# EAGLE design DMXRX (EAGLE 7.7.0)
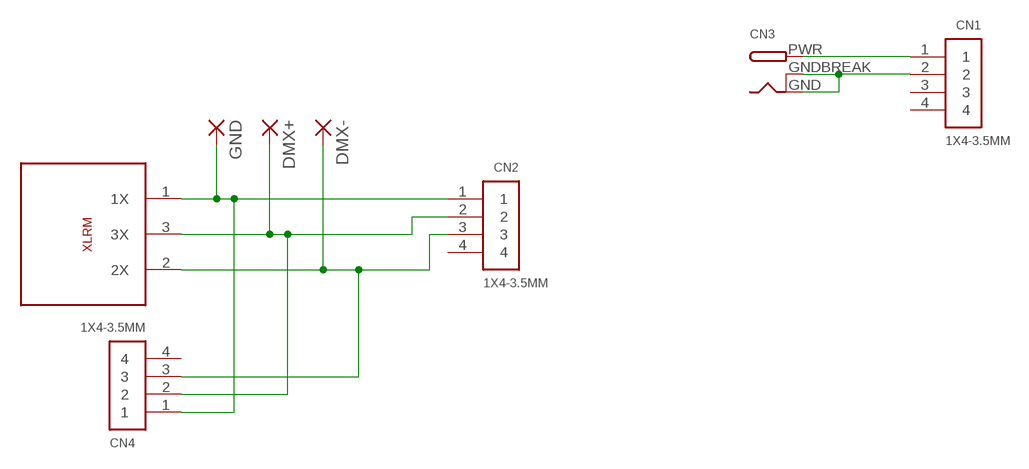
[diagram p0: schematic, sheet 1]

## Parts
CN1  1X4-3.5MM  [1X04-3.5MM]
CN2  1X4-3.5MM  [1X04-3.5MM]
CN3  DCBARRELPTH  [DCJACK_2MM_PTH]
CN4  1X4-3.5MM  [1X04-3.5MM]
DMX+  3,81/1,4  [3,81/1,4]
DMX-  3,81/1,4  [3,81/1,4]
GND  3,81/1,4  [3,81/1,4]
U$1  XLRCONNCTORM  [DMX3PINF]

## Nets
DMX+: CN2.2 CN4.2 DMX+.1(P) U$1.3(3X)
DMX-: CN2.3 CN4.3 DMX-.1(P) U$1.2(2X)
GND: CN2.1 CN4.1 GND.1(P) U$1.1(1X)
GNDP: CN1.2 CN3.GND CN3.GNDBREAK
PWR: CN1.1 CN3.PWR
Unconnected: CN1.3 CN1.4 CN2.4 CN4.4

## Library data of the parts
CN1 CN2 CN4 = adafruit:1X4: 4-pin connector
CN3 = adafruit:DCBARREL: 2.0mm DC Barrel Jack DCJACK_2MM_PTH - Through Hole Jack (4UConnector: 05537)
DMX+ DMX- GND = wirepad:3,81/1,4: THROUGH-HOLE PAD
U$1 = DMX:XLRCONNCTORM: SC1571-ND digikey

## Board
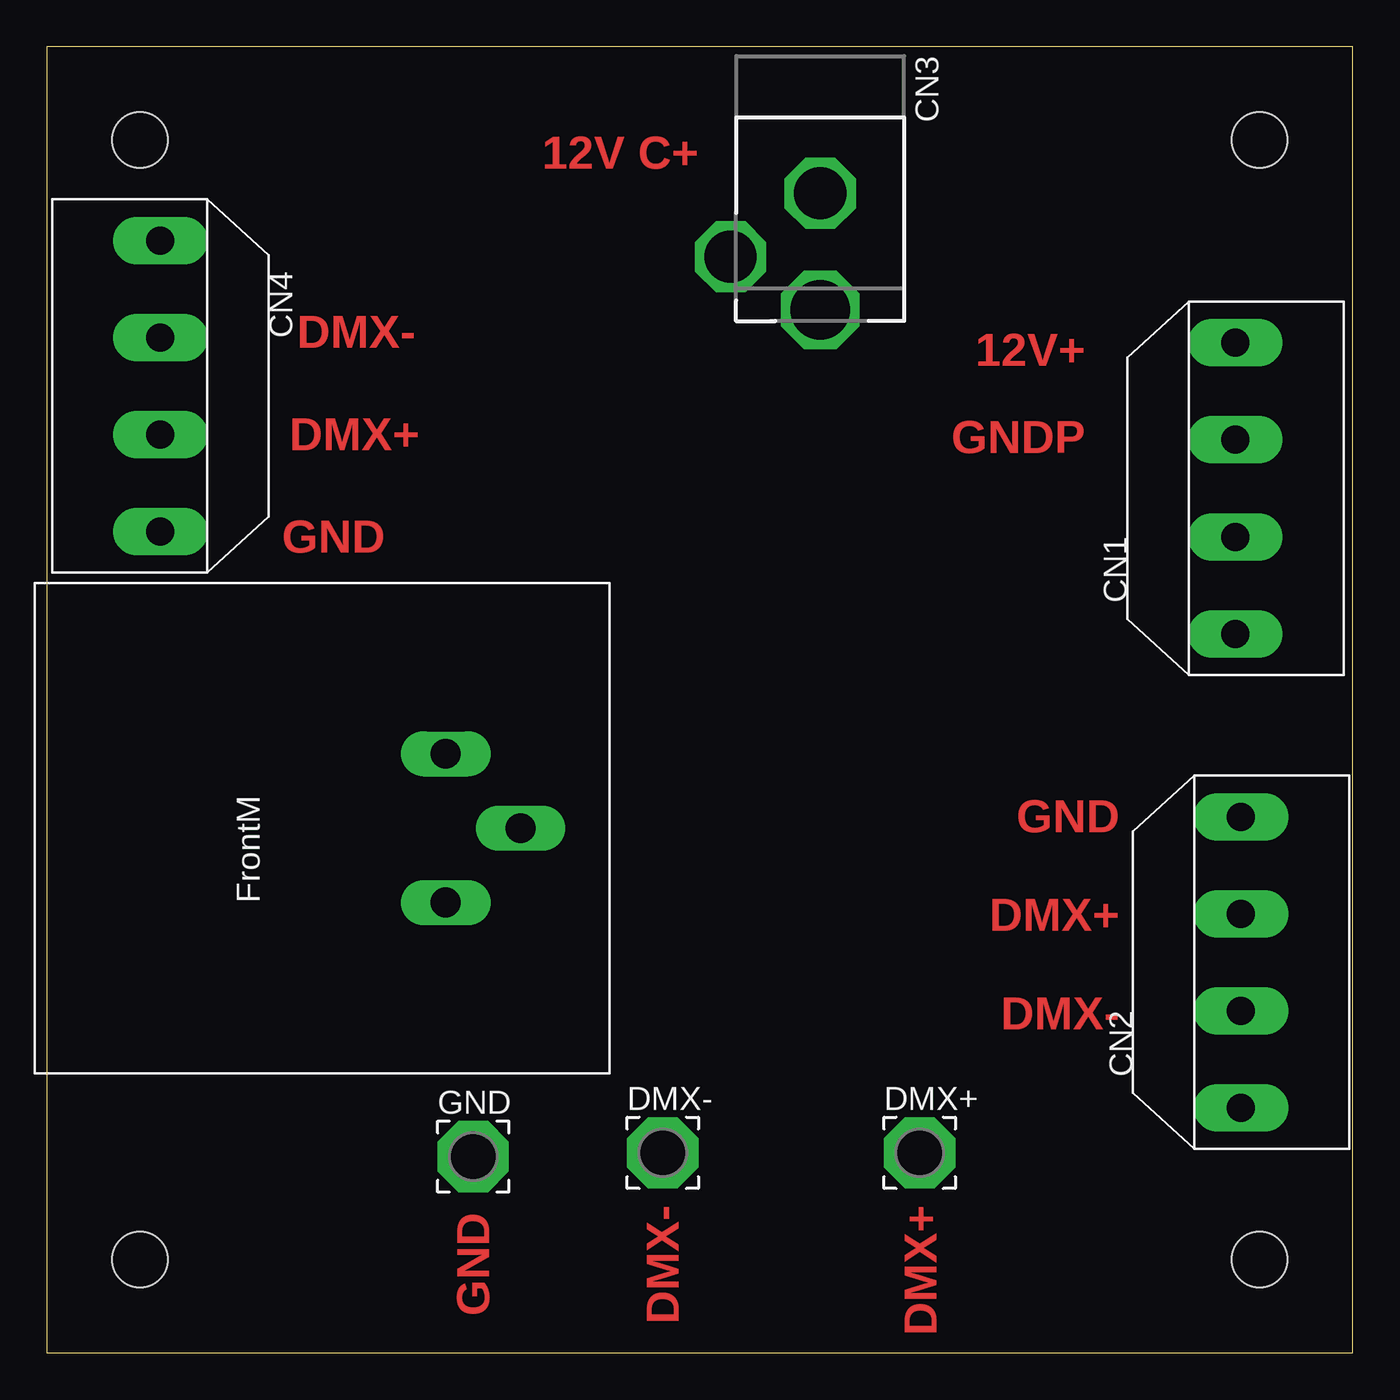
[diagram p1: board, top side]
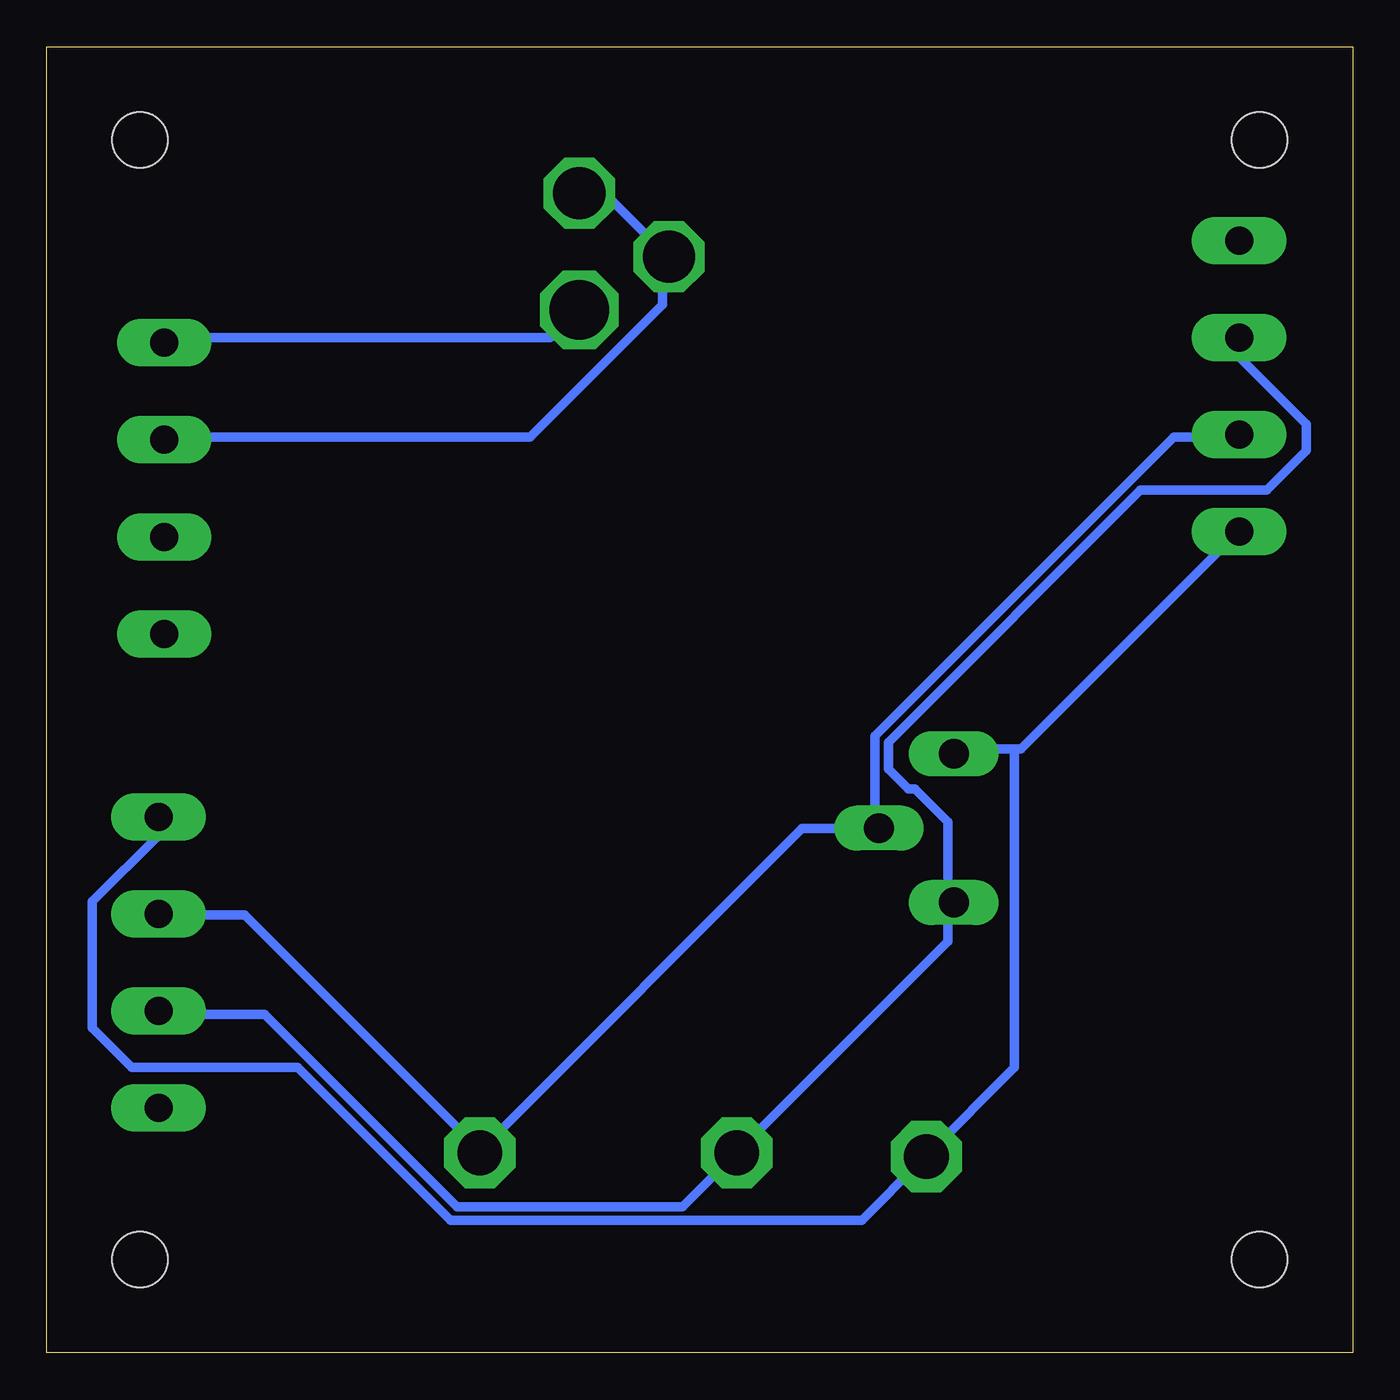
[diagram p2: board, bottom side, seen from below]

Size 70 x 70 mm. Coordinates in mm from the lower left corner, seen from the top.
Outline: 0,0 70,0 70,70 0,70 0,0
Copper layers (1*16): Top 0.035mm / dielectric 1.5mm / Bottom 0.035mm
Design rules "default *": minimum track width 20mil, minimum drill 0.8mm, track to track 8mil, track to pad 20mil, pad to pad 8mil, via to via 8mil, smd to smd 8mil, copper to edge 40mil, drill to drill 8mil, minimum pad ring 10mil, minimum via ring 8mil, stop-mask expansion 4mil, vias tented up to drill 0mil, thermal gap 10mil
Holes 3 mm at 5,5 65,5 65,65 5,65

### Footprints (pad centres in the part's own frame; a part is rotated, then mirrored left to right if it is on the bottom)
1X04-3.5MM = drill 1.5 pad 2.54 long: 1 -7.8,0; 2 -2.6,0; 3 2.6,0; 4 7.8,0
DCJACK_2MM_PTH = drill 2.8 octagon: GND 0,7.35; GNDBREAK 4.8,10.75 | drill 3.2 octagon: PWR 0,13.6
3,81/1,4 = drill 2.4 pad 3.81 octagon: 1 0,0
DMX3PINF = drill 1.6 long: 1 11.227,16.866; 2 11.227,8.89; 3 15.24,12.878

### Placement (x,y rotation side)
CN1  63.7,46.33 270 top
CN2  64.01,20.93 270 top
CN3  41.45,69.49 180 top
CN4  6.1,51.82 90 top
DMX+  46.79,10.72 0 top
DMX-  33.02,10.72 0 top
GND  22.86,10.52 0 top
U$1  10.16,15.24 0 top

### Tracks (layer width: path | path; a pad name or v marks a point on that pad's centre or on a via)
DMX+
  Bottom 0.508: CN2.2 64.01,23.47 59.38,23.47 46.94,11.02 DMX+.1 46.58,11.02 29.52,28.09 25.6,28.09 U$1.3 25.6,28.45 25.6,33.07 9.6,49.07 6.4,49.07 CN4.2
DMX-
  Bottom 0.508: CN4.3 6.04,54.41 6.04,53.34 2.49,49.78 2.49,48.36 4.62,46.23 11.38,46.23 24.89,32.72 24.89,31.29 23.82,30.23 23.47,30.23 21.69,28.45 21.69,24.18 U$1.2 21.69,23.82 21.69,22.05 DMX-.1 35.92,7.82 48.01,7.82 58.32,18.14 64.01,18.14 CN2.3
GND
  Bottom 0.508: 18.14,32.36 17.78,32.36 6.4,43.74 CN4.1 | 18.14,32.36 21.34,32.36 U$1.1 | CN2.1 64.01,27.74 67.56,24.18 67.56,17.42 65.43,15.29 56.54,15.29 48.36,7.11 26.31,7.11 23.11,10.31 GND.1 22.76,10.67 18.14,15.29 18.14,32.36
GNDP
  Bottom 0.508: CN1.2 63.65,49.07 44.09,49.07 36.98,56.19 36.98,58.67 CN3.GNDBREAK 36.98,59.03 39.83,61.87 41.25,61.87 CN3.GND
PWR
  Bottom 0.508: CN1.1 63.65,54.41 43.03,54.41 41.6,55.83 CN3.PWR

### Text on the board
Top: 12V C+ | 12V+ | DMX- | GNDP | DMX+ | GND | GND | DMX+ | DMX- | GND | DMX- | DMX+